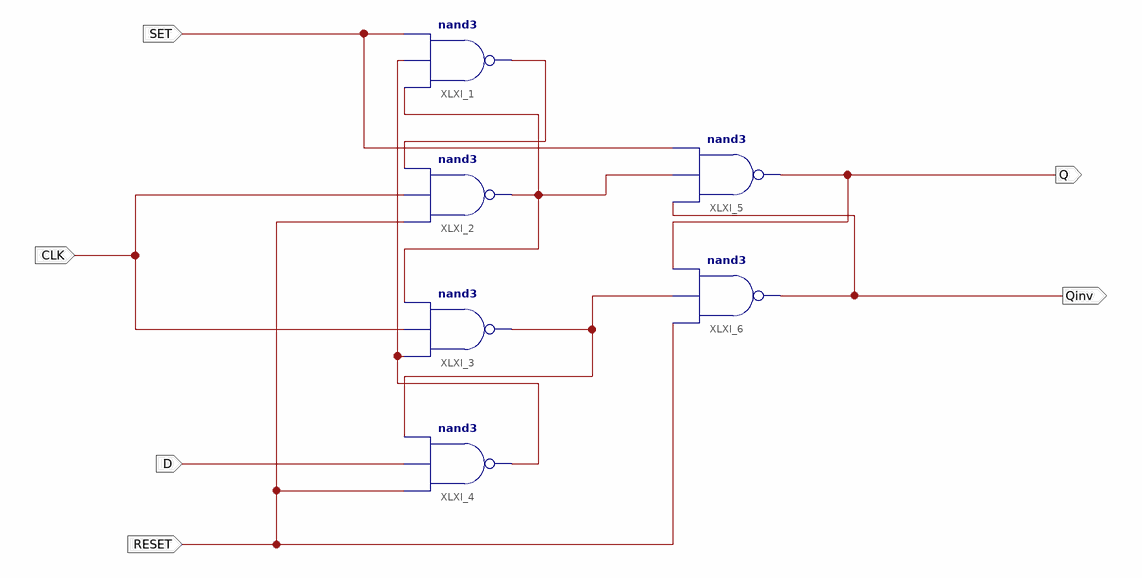
[diagram p0: schematic sheet 1]
// Xilinx ISE schematic dff.sch (artix7) as structural Verilog: 6 symbols, 6 ports
module dff (
  input  CLK,
  input  RESET,
  input  D,
  input  SET,
  output Q,
  output Qinv
);

  wire XLXN_4, XLXN_5, XLXN_9, XLXN_12;

  nand XLXI_1 (XLXN_4, XLXN_12, XLXN_5, SET);
  nand XLXI_2 (XLXN_12, RESET, CLK, XLXN_4);
  nand XLXI_3 (XLXN_9, XLXN_5, CLK, XLXN_12);
  nand XLXI_4 (XLXN_5, RESET, D, XLXN_9);
  nand XLXI_5 (Q, Qinv, XLXN_12, SET);
  nand XLXI_6 (Qinv, RESET, XLXN_9, Q);
endmodule
